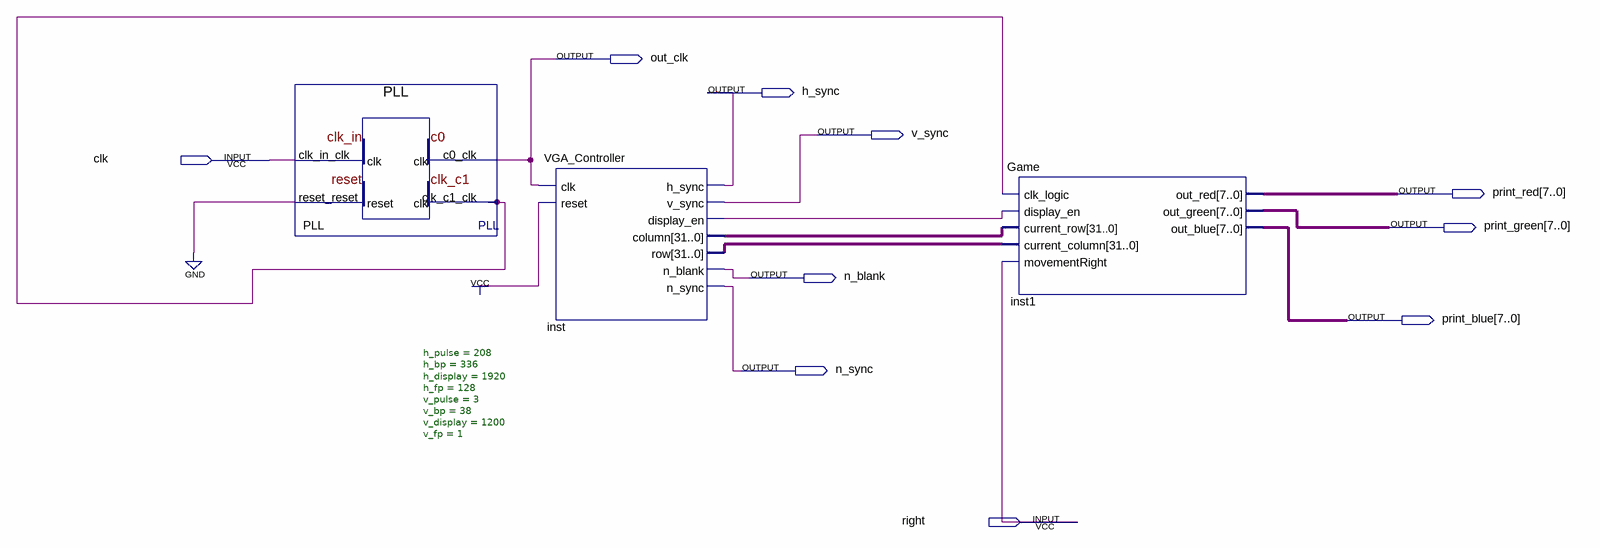
[diagram p0: schematic sheet]
// Quartus schematic VGA.bdf as structural Verilog: 3 symbols, 10 pins
module VGA (
  input  clk,
  input  right,
  output out_clk,
  output h_sync,
  output v_sync,
  output [7:0] print_red,
  output [7:0] print_green,
  output n_blank,
  output [7:0] print_blue,
  output n_sync
);

  wire inst_display_en, PLL_clk_c1_clk;
  wire [31:0] inst_column, inst_row;

  PLL PLL (.clk_in_clk(clk), .reset_reset(1'b0), .c0_clk(out_clk), .clk_c1_clk(PLL_clk_c1_clk));
  VGA_Controller #(.h_pulse(208), .h_bp(336), .h_display(1920), .h_fp(128), .v_pulse(3), .v_bp(38), .v_display(1200), .v_fp(1)) inst (
    .clk(out_clk), .reset(1'b1), .h_sync(h_sync), .v_sync(v_sync), .display_en(inst_display_en),
    .column(inst_column), .row(inst_row), .n_blank(n_blank), .n_sync(n_sync));
  Game inst1 (
    .clk_logic(PLL_clk_c1_clk), .display_en(inst_display_en), .current_row(inst_column),
    .current_column(inst_row), .movementRight(right), .out_red(print_red), .out_green(print_green),
    .out_blue(print_blue));
endmodule
